# EAGLE design pidplate-mk-2.1 (EAGLE 6.5.0)
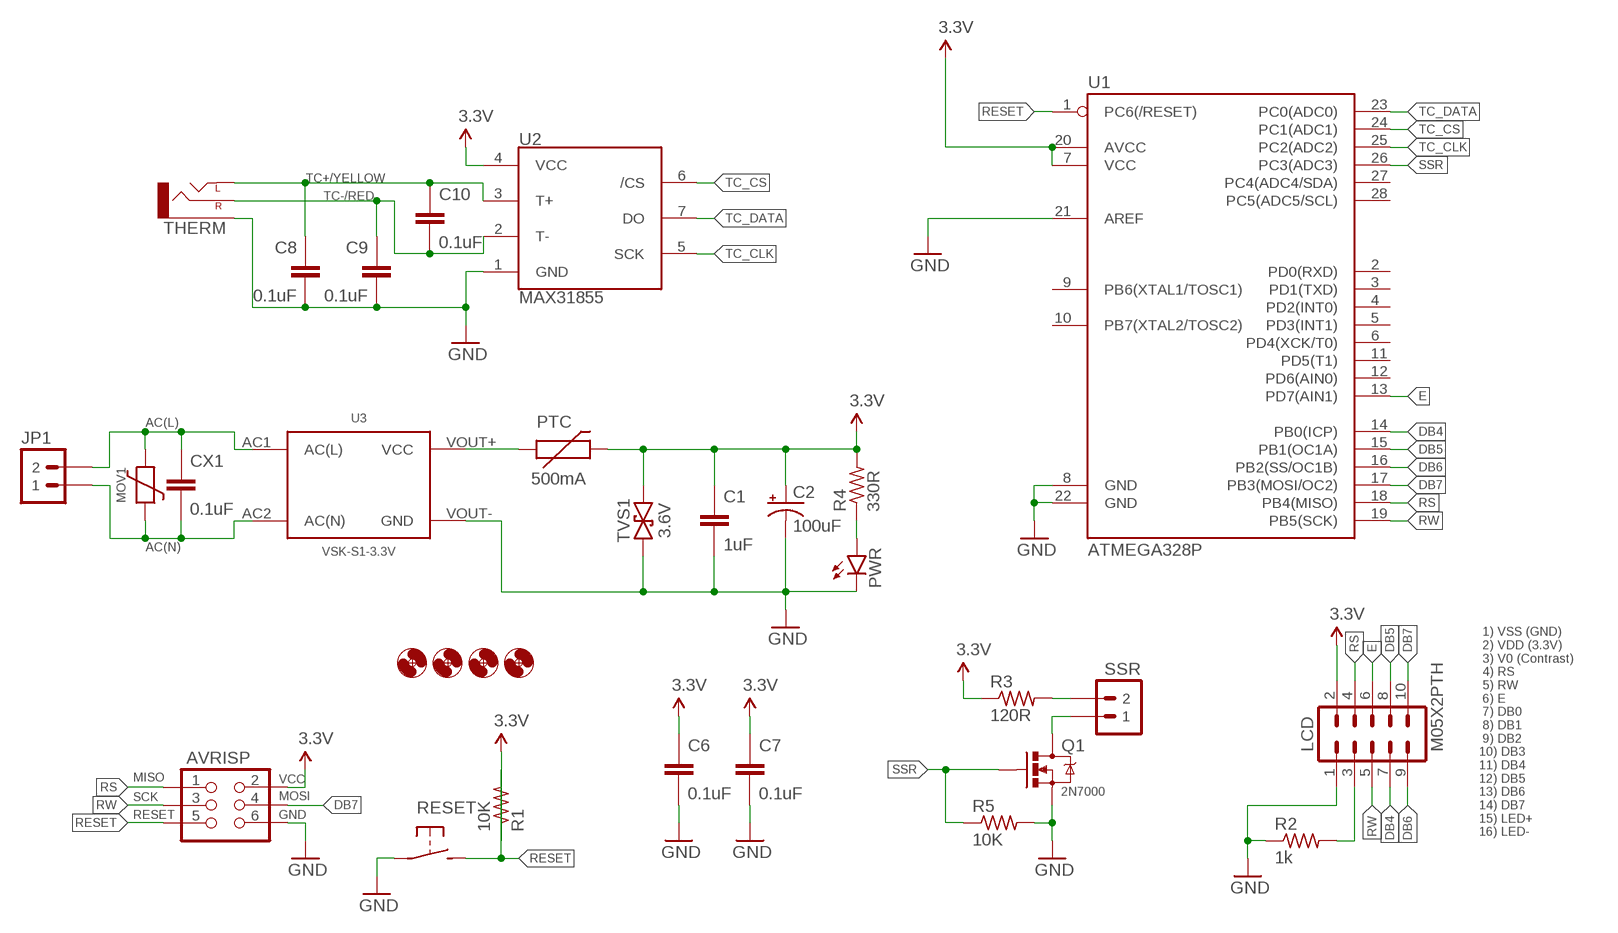
[diagram p0: schematic, sheet 1]

## Parts
AVRISP  AVR_SPI_PRG_6PTH  [2X3]
C1  1uF  CAPACITOR-CERAMIC025-024X044  [C025-024X044]
C2  100uF  CAPACITOR-POLARIZEDE2.5-7  [E2,5-7]
C6  0.1uF  CAPACITOR-CERAMIC025-024X044  [C025-024X044]
C7  0.1uF  CAPACITOR-CERAMIC025-024X044  [C025-024X044]
C8  0.1uF  CAPACITOR-CERAMIC025-024X044  [C025-024X044]
C9  0.1uF  CAPACITOR-CERAMIC025-024X044  [C025-024X044]
C10  0.1uF  CAPACITOR-CERAMIC025-024X044  [C025-024X044]
CX1  0.1uF  CXXC10B5  [XC10B5]
H1  HOLE#2  [HOLE-#2]
H2  HOLE#2  [HOLE-#2]
H3  HOLE#2  [HOLE-#2]
H4  HOLE#2  [HOLE-#2]
JP1  M023.5MM  [SCREWTERMINAL-3.5MM-2]
LCD  M05X2PTH  [AVR_ICSP]
MOV1  VARISITORVAR-5.08MM-PTH  [VAR-5.08MM-PTH]
PTC  500mA  PTCPTH  [PTC]
PWR  LED3MM  [LED3MM]
Q1  2N7000  MOSFET-NCHANNEL2N7000-AMMO  [TO-92-AMMO]
R1  10K  RESISTORPTH-AXIAL-6.35MM  [RESISTOR-AXIAL-PTH-6.35MM]
R2  1k  RESISTORPTH-AXIAL-6.35MM  [RESISTOR-AXIAL-PTH-6.35MM]
R3  120R  RESISTORPTH-AXIAL-6.35MM  [RESISTOR-AXIAL-PTH-6.35MM]
R4  330R  RESISTORPTH-AXIAL-6.35MM  [RESISTOR-AXIAL-PTH-6.35MM]
R5  10K  RESISTORPTH-AXIAL-6.35MM  [RESISTOR-AXIAL-PTH-6.35MM]
RESET  SPST-NO-TACT3MM-PTH-SMALL-PADS  [DTS-3-SMALL-PADS]
SSR  M02JST-PTH-VERT  [JST-2-PH-VERT-PTH]
THERM  AUDIO-JACK2.5MM  [STEREOJACK2.5MM_STEREOJACK2.5MM]
TVS1  3.6V  TVSDO-41-TVS-BIDIRECTIONAL  [DO-41-TVS]
U1  ATMEGA328P  ATMEGA328P_PDIP  [DIL28-3]
U2  MAX31855  MAX31855SOIC  [SOIC127P600X175-8N]
U3  VSK-S1-3.3V  VSK-S1  [VSK-S1]

## Nets
3.3V: AVRISP.2(VCC) C1.1 C2.+ C6.1 C7.1 LCD.2 PTC.P$2 R1.P$1 R3.P$1 R4.P$2 TVS1.P$2 U1.7(VCC) U1.20(AVCC) U2.4(VCC)
AC(L): CX1.1 JP1.2 MOV1.2 U3.AC1(AC(L))
AC(N): CX1.2 JP1.1 MOV1.1 U3.AC2(AC(N))
DB4: LCD.7 U1.14(PB0(ICP))
DB5: LCD.8 U1.15(PB1(OC1A))
DB6: LCD.9 U1.16(PB2(SS/OC1B))
DB7: AVRISP.4(MOSI) LCD.10 U1.17(PB3(MOSI/OC2))
E: LCD.6 U1.13(PD7(AIN1))
GND: AVRISP.6(GND) C1.2 C2.- C6.2 C7.2 C8.2 C9.2 LCD.1 PWR.K(C) Q1.1(S) R2.P$1 R5.P$2 RESET.1 THERM.SHIELD(SLEEVE) TVS1.P$1 U1.8(GND) U1.21(AREF) U1.22(GND) U2.1(GND) U3.VOUT-(GND)
N$1: PTC.P$1 U3.VOUT+(VCC)
N$2: LCD.3 R2.P$2
N$6: R3.P$2 SSR.2
N$9: Q1.3(D) SSR.1
N$10: PWR.A R4.P$1
RESET: AVRISP.5(RESET) R1.P$2 RESET.2 U1.1(PC6(/RESET))
RS: AVRISP.1(MISO) LCD.4 U1.18(PB4(MISO))
RW: AVRISP.3(SCK) LCD.5 U1.19(PB5(SCK))
SSR: Q1.2(G) R5.P$1 U1.26(PC3(ADC3))
TC+/YELLOW: C8.1 C10.1 THERM.RING1(LEFT) THERM.RING2(LEFT) U2.3(T+)
TC-/RED: C9.1 C10.2 THERM.TIP(RIGHT) U2.2(T-)
TC_CLK: U1.25(PC2(ADC2)) U2.5(SCK)
TC_CS: U1.24(PC1(ADC1)) U2.6(/CS)
TC_DATA: U1.23(PC0(ADC0)) U2.7(DO)
Unconnected: U1.2(PD0(RXD)) U1.3(PD1(TXD)) U1.4(PD2(INT0)) U1.5(PD3(INT1)) U1.6(PD4(XCK/T0)) U1.9(PB6(XTAL1/TOSC1)) U1.10(PB7(XTAL2/TOSC2)) U1.11(PD5(T1)) U1.12(PD6(AIN0)) U1.27(PC4(ADC4/SDA)) U1.28(PC5(ADC5/SCL))

## Notes on the sheet
- 1) VSS (GND)
   2) VDD (3.3V)
   3) V0 (Contrast)
   4) RS
   5) RW
   6) E
   7) DB0
   8) DB1
   9) DB2
  10) DB3
  11) DB4
  12) DB5
  13) DB6
  14) DB7
  15) LED+
  16) LED-

## Library data of the parts
AVRISP = A_butts:AVR_SPI_PRG_6: AVR ISP 6 Pin This is the reduced ISP connector for AVR programming. Common on Arduino. This footprint will take up less PCB space and can be used with a 10-pin to 6-pin adapter such as SKU: BOB-08508 **Special note about "TEST_POINT" package. The stop mask is on the top side, so if you want your programming test points to be on the bottom of your board, make sure to place this package on the bottom side of the board. This also ensure that the orientation to program from the bottom side will be correct.
C1 C6-C10 = A_butts:CAPACITOR-CERAMIC: CAPACITOR, European symbol
C2 = A_butts:CAPACITOR-POLARIZED: POLARIZED CAPACITOR, American symbol
CX1 = A_butts:CX: X CAPACITOR for power line
H1-H4 = A_butts:HOLE: MOUNTING HOLE with drill center marker
JP1 SSR = A_butts:M02: Standard 2-pin 0.1" header. Use with - straight break away headers ( PRT-00116) - right angle break away headers (PRT-00553) - swiss pins (PRT-00743) - machine pins (PRT-00117) - female headers (PRT-00115) Molex polarized connector foot print use with: PRT-08233 with associated crimp pins and housings. 2.54_SCREWTERM for use with PRT-10571. 3.5mm Screw Terminal footprints for PRT-08084 5mm Screw Terminal footprints for use with PRT-08433
LCD = A_butts:M05X2: Header 5x2 Standard 10-pin dual row 0.1" header. Commonly used with AVR-ISP. Use with Spark Fun Electronics SKU: PRT-00778
MOV1 = A_butts:VARISITOR
PTC = A_butts:PTC: Resettable Fuse PTC Resettable Fuse. Spark Fun Electronics SKU : COM-08357
PWR = A_butts:LED: LEDs Standard schematic elements and footprints for 5mm, 3mm, 1206, and 0603 sized LEDs. 5mm - Spark Fun Electronics SKU : COM-00529 (and others)
Q1 = A_butts:MOSFET-NCHANNEL: Common NMOSFET Parts MFG P/N Store ID Prod ID FDD8780 TRANS-09984 SI7820DN TRANS-11055 FDS6630A IC-08089 2N7002PW TRANS-11151 FQP30N06L COM-10213 TRANS-10060 BSS123LT1G TRANS-08345 BSS138 TRANS-00830 BS170 2N7000
R1-R5 = A_butts:RESISTOR: RESISTOR, American symbol
RESET = A_butts:SPST-NO-TACT
THERM = A_butts:AUDIO-JACK: 3.5mm Audio Jack Simple 3.5mm common PCB mount audio jack. SKU: PRT-08032
TVS1 = A_butts:TVS: Transient voltage suppressor- prevents ESD on inputs. Ignore package description- MBRA140 is NOT this type of part!!!
U1 = A_butts:ATMEGA328P_PDIP: uC used in the Arduino 32kb flash, 1k EEPROM, 2k SRAM This is the through-hole version of this chip.
U2 = A_butts:MAX31855
U3 = A_butts:VSK-S1: VSK-S1 is an AC/DC converter for PCB mounting.

## Board
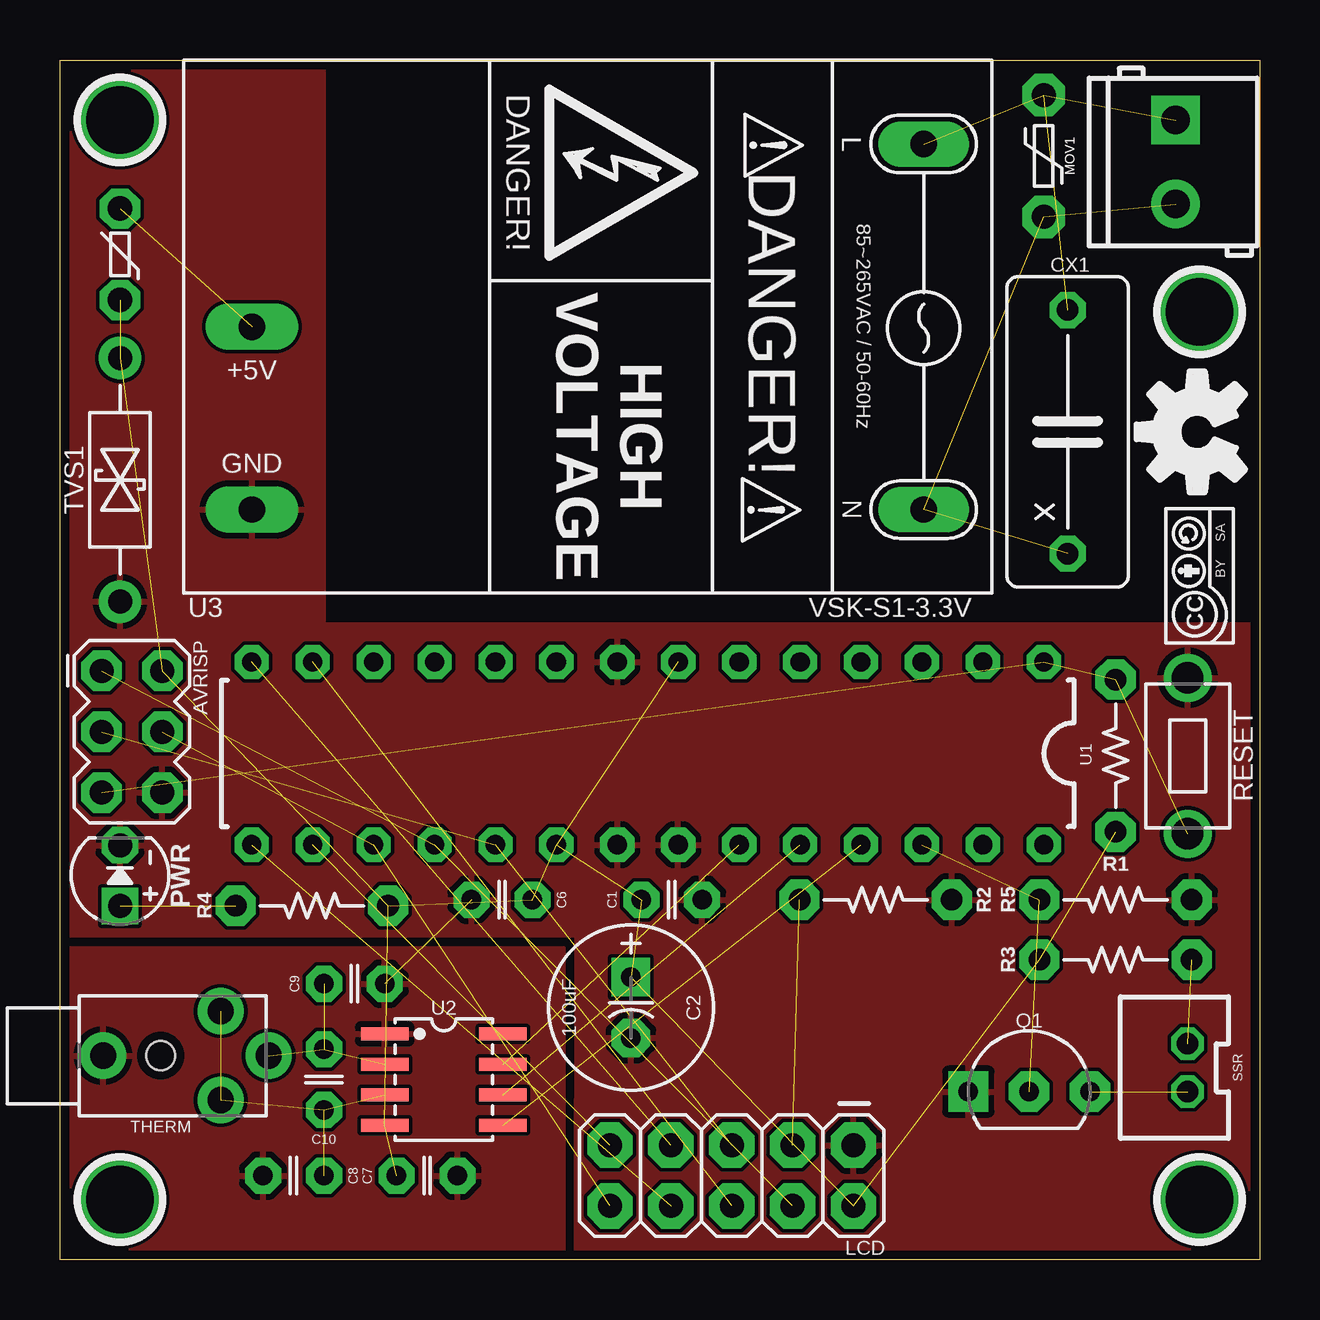
[diagram p1: board, top side]
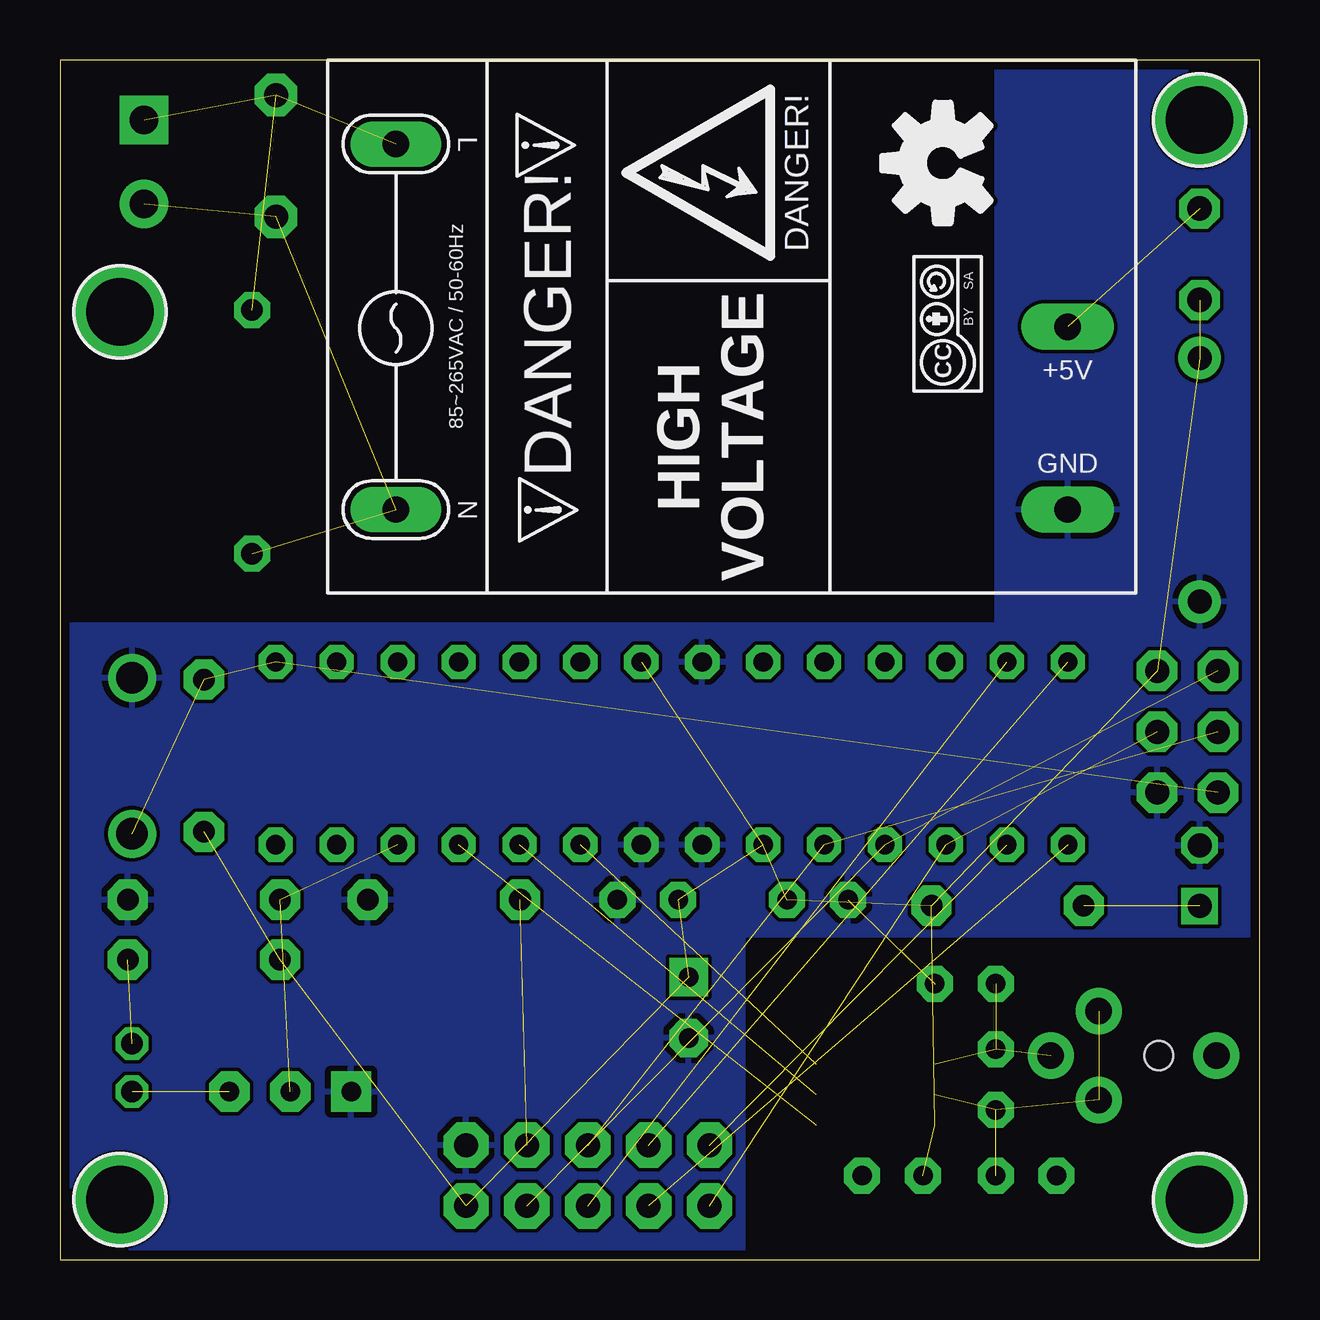
[diagram p2: board, bottom side, seen from below]

Size 50 x 50 mm. Coordinates in mm from the lower left corner, seen from the top.
Outline: 0,50 50,50 50,0 0,0 0,50
Copper layers (1*16): Top 0.0356mm / dielectric 1.5011mm / Bottom 0.0356mm
Design rules "LaenPCBOrder2": minimum track width 6mil, minimum drill 13mil, track to track 6mil, track to pad 6mil, pad to pad 6mil, via to via 6mil, smd to smd 6mil, copper to edge 15mil, drill to drill 6mil, minimum pad ring 7mil, minimum via ring 7mil, stop-mask expansion 3mil, vias tented up to drill 20mil, thermal gap 10mil

### Footprints (pad centres in the part's own frame; a part is rotated, then mirrored left to right if it is on the bottom)
2X3 = drill 1 pad 1.676 octagon: 1 -2.54,-1.27; 2 -2.54,1.27; 3 0,-1.27; 4 0,1.27; 5 2.54,-1.27; 6 2.54,1.27
C025-024X044 = drill 0.813 pad 1.5 octagon: 1 -1.27,0; 2 1.27,0
E2,5-7 = drill 0.813 pad 1.6 square: + -1.27,0 | drill 0.813 pad 1.6 octagon: - 1.27,0
XC10B5 = drill 0.9 pad 1.5 octagon: 1 -5.08,0; 2 5.08,0
HOLE-#2 = drill 2.8 pad 3.81: P$1 0,0
SCREWTERMINAL-3.5MM-2 = drill 1.2 pad 2.032 square: 1 0,0 | drill 1.2 pad 2.032: 2 3.5,0
AVR_ICSP = drill 1 pad 1.88 octagon: 1 -5.08,-1.27; 2 -5.08,1.27; 3 -2.54,-1.27; 4 -2.54,1.27; 5 0,-1.27; 6 0,1.27; 7 2.54,-1.27; 8 2.54,1.27; 9 5.08,-1.27; 10 5.08,1.27
VAR-5.08MM-PTH = drill 1 pad 1.778 octagon: 1 -2.54,0; 2 2.54,0
PTC = drill 1.016 pad 1.676 octagon: P$1 -1.905,0; P$2 1.905,0
LED3MM = drill 1 pad 1.524 square: A -1.27,0 | drill 1 pad 1.524 octagon: K 1.27,0
TO-92-AMMO = drill 0.813 pad 1.676 square: 1 -2.54,0 | drill 0.813 pad 1.676 octagon: 2 0,0; 3 2.54,0
RESISTOR-AXIAL-PTH-6.35MM = drill 0.9 pad 1.676 octagon: P$1 -3.175,0; P$2 3.175,0
DTS-3-SMALL-PADS = drill 1.3 pad 2: 1 -3.25,0; 2 3.25,0
JST-2-PH-VERT-PTH = drill 0.9 octagon: 1 -1,0; 2 1,0
STEREOJACK2.5MM_STEREOJACK2.5MM = drill 1.1 pad 1.93: RING1 2.5,-1.85; RING2 2.5,1.85; SHIELD -2.4,0; TIP 4.5,0 | hole 1.2: 0,0
DO-41-TVS = drill 1 pad 1.778: P$1 -5.08,0; P$2 5.08,0
DIL28-3 = drill 0.8 pad 1.422 octagon: 1 -16.51,-3.81; 2 -13.97,-3.81; 3 -11.43,-3.81; 4 -8.89,-3.81; 5 -6.35,-3.81; 6 -3.81,-3.81; 7 -1.27,-3.81; 8 1.27,-3.81; 9 3.81,-3.81; 10 6.35,-3.81; 11 8.89,-3.81; 12 11.43,-3.81; 13 13.97,-3.81; 14 16.51,-3.81; 15 16.51,3.81; 16 13.97,3.81; 17 11.43,3.81; 18 8.89,3.81; 19 6.35,3.81; 20 3.81,3.81; 21 1.27,3.81; 22 -1.27,3.81; 23 -3.81,3.81; 24 -6.35,3.81; 25 -8.89,3.81; 26 -11.43,3.81; 27 -13.97,3.81; 28 -16.51,3.81
SOIC127P600X175-8N = smd 1.981 x 0.559: 1 -2.464,1.905; 2 -2.464,0.635; 3 -2.464,-0.635; 4 -2.464,-1.905; 5 2.464,-1.905; 6 2.464,-0.635; 7 2.464,0.635; 8 2.464,1.905
VSK-S1 = drill 1.1 pad 1.9 long: AC1 0,15.24; AC2 0,0 | drill 1.1 pad 1.93 long: VOUT+ 28,7.62; VOUT- 28,15.24

### Placement (x,y rotation side)
AVRISP  3,22 270 top
C1  25.5,15 0 top
C2  23.8,10.5 270 top
C6  18.42,15 180 top
C7  15.3,3.5 0 top
C8  9.73,3.5 180 top
C9  12.27,11.5 0 top
C10  11,7.5 90 top
CX1  42,34.5 90 top
H1  47.5,39.5 0 top
H2  2.5,47.5 0 top
H3  2.5,2.5 0 top
H4  47.5,2.5 0 top
JP1  46.5,47.5 270 top
LCD  28,3.5 180 top
MOV1  41,46 270 top
PTC  2.5,41.9 270 top
PWR  2.5,16 90 top
Q1  40.4,7 0 top
R1  44,21 90 top
R2  34,15 180 top
R3  44,12.5 0 top
R4  10.5,14.75 0 top
R5  44,15 0 top
RESET  47,21 270 top
SSR  47,8 90 top
THERM  4.2,8.5 0 top
TVS1  2.5,32.5 90 top
U1  24.5,21.1 180 top
U2  16,7.5 0 top
U3  36,46.5 180 top
U$1  [OSHWLOGO_BOT_0.2]  47.4,34.5 270 bottom
U$2  [CC-BY-SA-4.0-NO-URL]  47.5,28.5 90 top
U$3  [CC-BY-SA-4.0-NO-URL]  13,39 90 bottom
U$4  [OSHWLOGO_BOT_0.2]  13.2,45.7 270 top

### Tracks (layer width: path | path; a pad name or v marks a point on that pad's centre or on a via)
3.3V  (13 unrouted)
AC(L)  (3 unrouted)
AC(N)  (3 unrouted)
DB4  (1 unrouted)
DB5  (1 unrouted)
DB6  (1 unrouted)
DB7  (2 unrouted)
E  (1 unrouted)
GND  (1 unrouted)
  pour Top: 11,26.5 50,26.5 50,0 21.5,0 21.5,13.5 0,13.5 0,50 11,50
  pour Bottom: 21.5,0 21.5,13.5 0,13.5 0,50 11,50 11,26.5 50,26.5 50,0
  pour Top: 0,13 21,13 21,0 0,0
N$1  (1 unrouted)
N$2  (1 unrouted)
N$6  (1 unrouted)
N$9  (1 unrouted)
N$10  (1 unrouted)
RESET  (3 unrouted)
RS  (2 unrouted)
RW  (2 unrouted)
SSR  (2 unrouted)
TC+/YELLOW  (4 unrouted)
TC-/RED  (3 unrouted)
TC_CLK  (1 unrouted)
TC_CS  (1 unrouted)
TC_DATA  (1 unrouted)